# EAGLE schematic RC-car-STM32 (EAGLE 9.6.2)
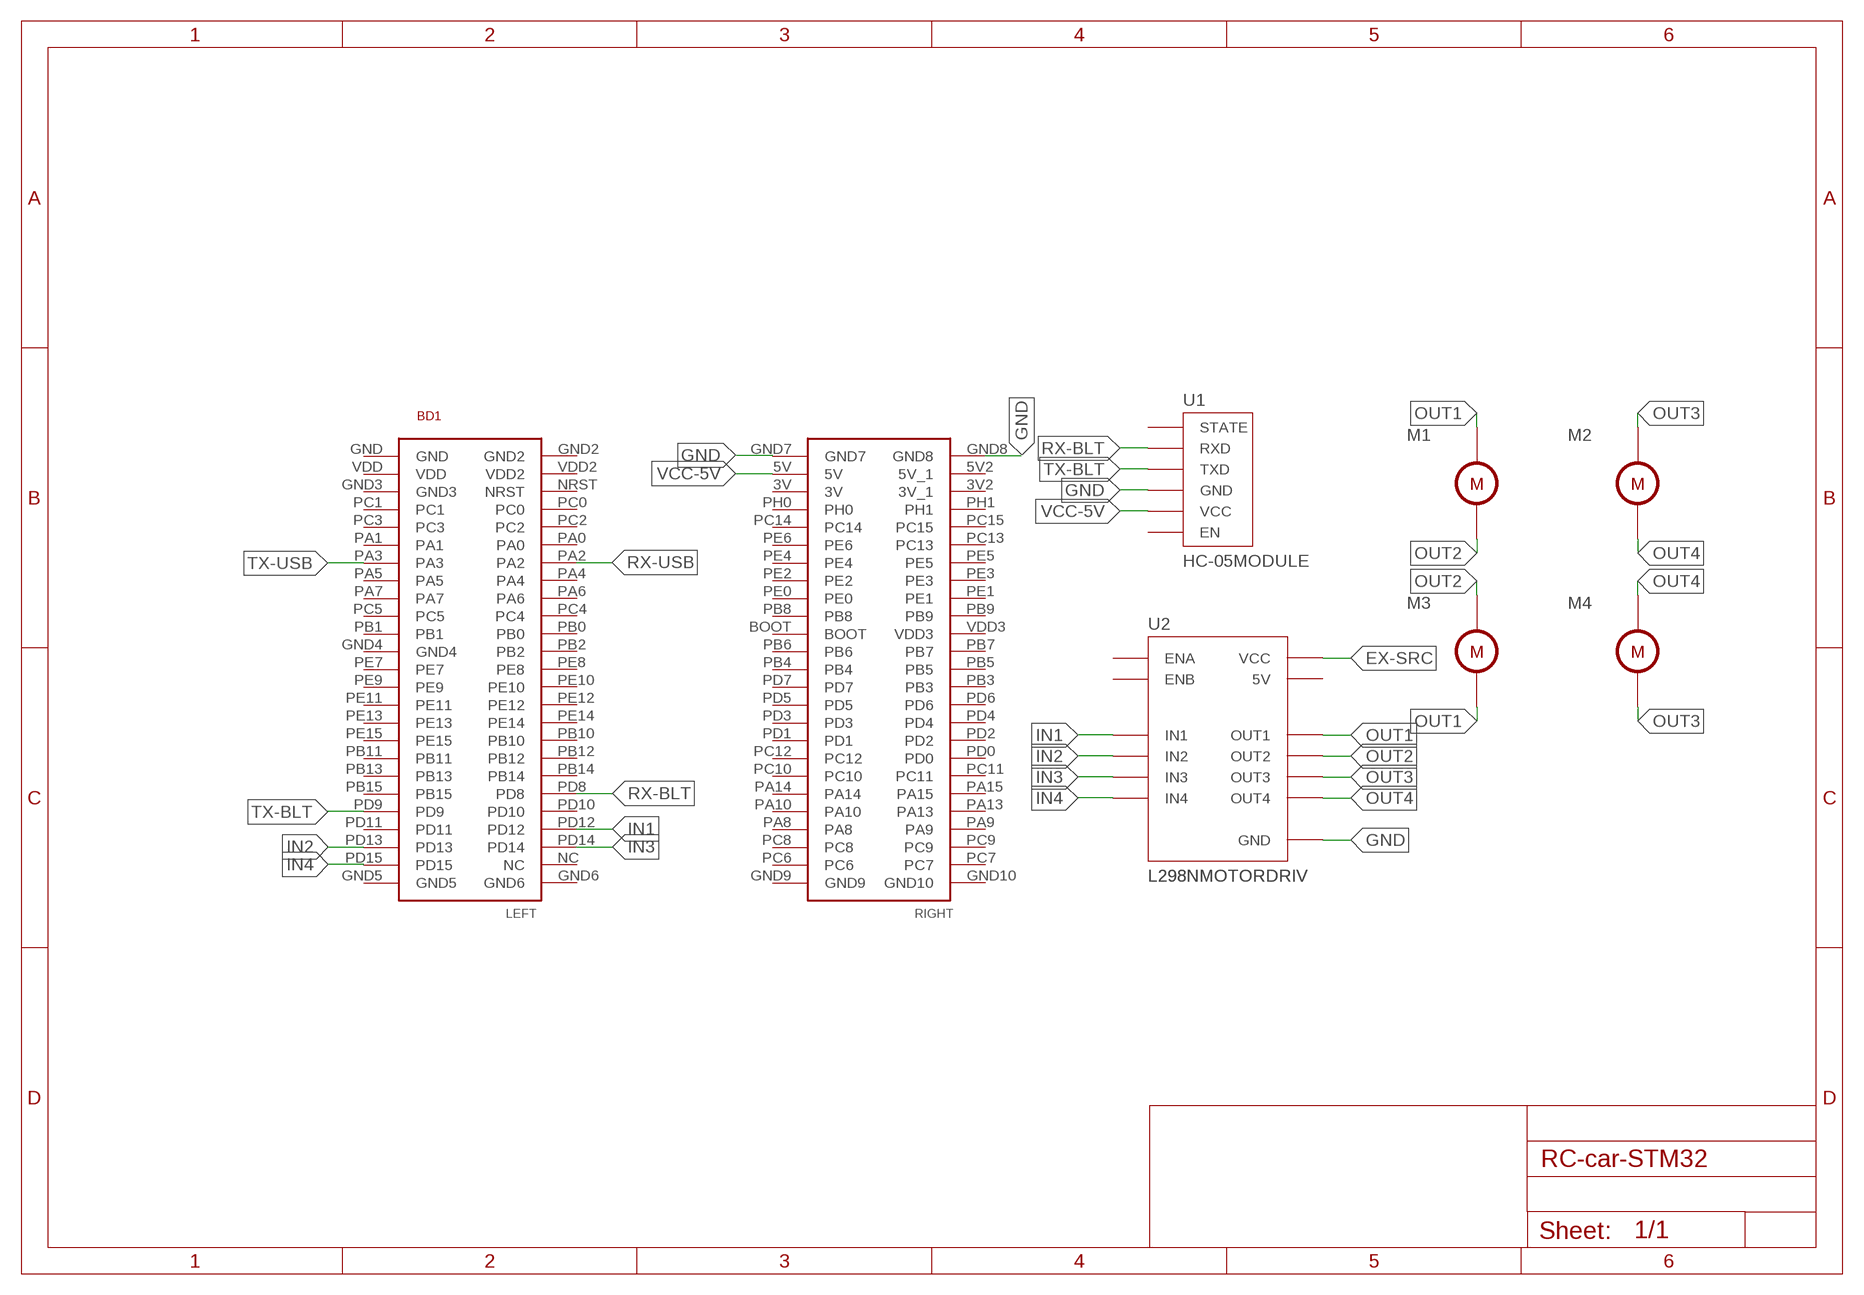
[diagram p0: schematic, sheet 1]

## Parts
BD1  STM32F4-DISCOVERY  [STM32F407VG]
M1  DC-MOTOR  [DC-MOTOR]
M2  DC-MOTOR  [DC-MOTOR]
M3  DC-MOTOR  [DC-MOTOR]
M4  DC-MOTOR  [DC-MOTOR]
U1  HC-05MODULE  [HC-05MODULE]
U2  L298NMOTORDRIV  [L289NMOTORDRIV]

## Nets
EX-SRC: U2.VCC
GND: BD1.GND7 BD1.GND8 U1.GND U2.GND
IN1: BD1.PD12 U2.IN1
IN2: BD1.PD13 U2.IN2
IN3: BD1.PD14 U2.IN3
IN4: BD1.PD15 U2.IN4
OUT1: M1.+ M3.- U2.OUT1
OUT2: M1.- M3.+ U2.OUT2
OUT3: M2.+ M4.- U2.OUT3
OUT4: M2.- M4.+ U2.OUT4
RX-BLT: BD1.PD8 U1.RXD
RX-USB: BD1.PA2
TX-BLT: BD1.PD9 U1.TXD
TX-USB: BD1.PA3
VCC-5V: BD1.5V U1.VCC
Unconnected: BD1.3V BD1.3V2(3V_1) BD1.5V2(5V_1) BD1.BOOT BD1.GND BD1.GND2 BD1.GND3 BD1.GND4 BD1.GND5 BD1.GND6 BD1.GND9 BD1.GND10 BD1.NC BD1.NRST BD1.PA0 BD1.PA1 BD1.PA4 BD1.PA5 BD1.PA6 BD1.PA7 BD1.PA8 BD1.PA9 BD1.PA10 BD1.PA13 BD1.PA14 BD1.PA15 BD1.PB0 BD1.PB1 BD1.PB2 BD1.PB3 BD1.PB4 BD1.PB5 BD1.PB6 BD1.PB7 BD1.PB8 BD1.PB9 BD1.PB10 BD1.PB11 BD1.PB12 BD1.PB13 BD1.PB14 BD1.PB15 BD1.PC0 BD1.PC1 BD1.PC2 BD1.PC3 BD1.PC4 BD1.PC5 BD1.PC6 BD1.PC7 BD1.PC8 BD1.PC9 BD1.PC10 BD1.PC11 BD1.PC12 BD1.PC13 BD1.PC14 BD1.PC15 BD1.PD0 BD1.PD1 BD1.PD2 BD1.PD3 BD1.PD4 BD1.PD5 BD1.PD6 BD1.PD7 BD1.PD10 BD1.PD11 BD1.PE0 BD1.PE1 BD1.PE2 BD1.PE3 BD1.PE4 BD1.PE5 BD1.PE6 BD1.PE7 BD1.PE8 BD1.PE9 BD1.PE10 BD1.PE11 BD1.PE12 BD1.PE13 BD1.PE14 BD1.PE15 BD1.PH0 BD1.PH1 BD1.VDD BD1.VDD2 BD1.VDD3 U1.EN U1.STATE U2.5V U2.ENA U2.ENB

## Library data of the parts
BD1 = STM32F4 DISCOVERY:STM32F4-DISCOVERY: STM32F4DISCOVERY STM32F407VG Create by Jairo Reyes Email: jairo.314@hotmail.com
M1-M4 = DC-MOTOR:DC-MOTOR
U1 = HC-05MODULE:HC-05MODULE
U2 = L298NMOTORDRIV:L298NMOTORDRIV